# Altium schematic sheet POWER_NODE.SchDoc
size A
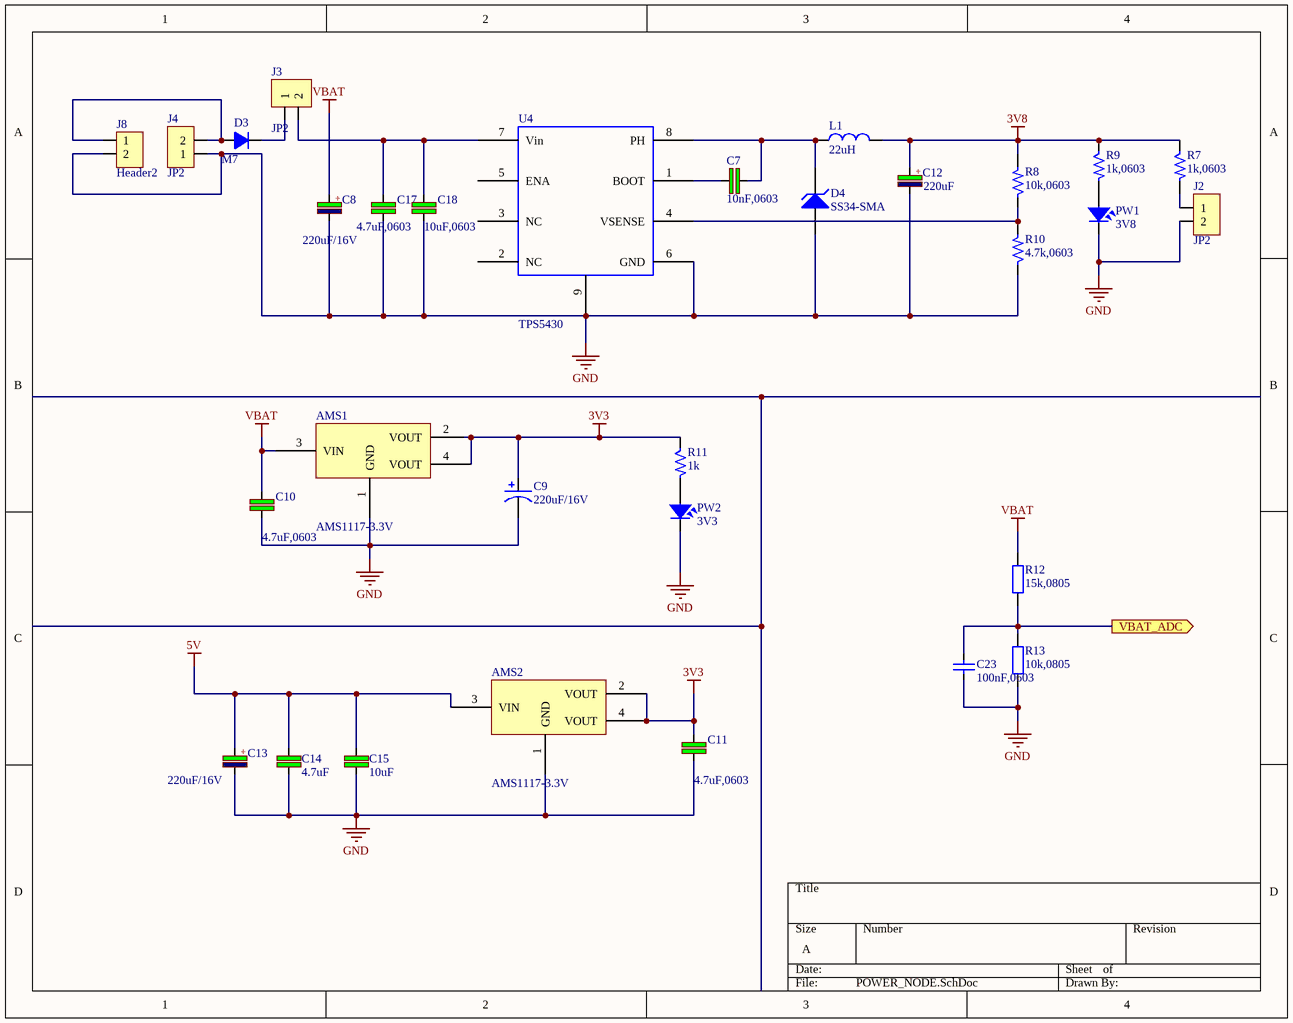
[diagram p0: POWER_NODE.SchDoc]

## Parts
AMS1  AMS1117-3.3V  [SOT223]
AMS2  AMS1117-3.3V  [SOT223]
C7  value 10nF,0603  [CAP_0603]  (hidden comment: 4.7uF)
C8  220uF/16V  [C8mm]
C9  220uF/16V  [C5mm]
C10  value 4.7uF,0603  [CAP_0603]  (hidden comment: 33pF)
C11  value 4.7uF,0603  [CAP_0603]  (hidden comment: 33pF)
C12  220uF  [C5mm]
C13  220uF/16V  [C8mm]
C14  4.7uF  [CAP_0603]
C15  10uF  [CAP_0603]
C17  value 4.7uF,0603  [CAP_0603]  (hidden comment: 4.7uF)
C18  value 10uF,0603  [CAP_0603]  (hidden comment: 4.7uF)
C23  100nF,0603  [CAP_0603]
D3  M7  [SMA]
D4  SS34-SMA  [SMA]
J2  JP2  [JP2-D1T]
J3  JP2  [KF2-5.08]
J4  JP2  [KF2-5.08]
J8  Header2  [KF2-5.08]
L1  22uH  [L-SMD-M-7.3x4.5]
PW1  3V8  [LED-0805-Blue]
PW2  3V3  [LED-0805-Blue]
R7  1k,0603  [RES-SMD-0603]
R8  10k,0603  [RES-SMD-0603]
R9  1k,0603  [RES-SMD-0603]
R10  4.7k,0603  [RES-SMD-0603]
R11  1k  [RES-SMD-0603]
R12  15k,0805  [RES-SMD-0805]
R13  10k,0805  [RES-SMD-0805]
U4  TPS5430  [TPS5430-2]

## Ports
VBAT_ADC (out)

## Nets
3V3: AMS1.2(VOUT) AMS1.4(VOUT) AMS2.2(VOUT) AMS2.4(VOUT) C9.1 C11.2 R11.1
3V8: C12.1 L1.2 R7.1 R8.2 R9.1
5V: AMS2.3(VIN) C13.1 C14.1 C15.1
GND: AMS1.1(GND) AMS2.1(GND) C8.2 C9.2 C10.1 C11.1 C12.2 C13.2 C14.2 C15.2 C17.1 C18.1 C23.1 D4.1(A) J2.2 J4.1 J8.2 PW1.2 PW2.2 R10.1 R13.1 U4.6(GND) U4.9(PWR_PAD)
VBAT: AMS1.3(VIN) C8.1 C10.2 R12.2
VBAT_ADC: C23.2 R12.1 R13.2 ; port VBAT_ADC
NetC7_1: C7.1 D4.2(K) L1.1 U4.8(PH)
NetC7_2: C7.2 U4.1(BOOT)
NetC17_2: C17.2 C18.2 J3.2 U4.7(Vin)
NetD3_1: D3.1(A) J4.2 J8.1
NetD3_2: D3.2(K) J3.1
NetJ2_1: J2.1 R7.2
NetPW1_1: PW1.1 R9.2
NetPW2_1: PW2.1 R11.2
NetR8_1: R8.1 R10.2 U4.4(VSENSE)

Not connected (* = marked no-connect by the designer): U4 2(NC) 3(NC) 5(ENA)

## Notes on the sheet
- (in symbol CP3) +
- (in symbol CP5) +

## Library data of the parts
AMS1 AMS2 = AMS1117 SMD: Dán; Value: AMS1117-3.3V SOT223; Don_Vi: Con; Ma_Hang: MH000596; Ghi_Chu: *; Kieu_Chan: *; Chung_Loai: Dán
C7 C10 C11 C17 C18 = C: 4.7µF ±10% 35V Ceramic Capacitor X5R 0805 (2012 Metric); Manufacturer: Samsung Electro-Mechanics; Part number: CL21A475KLCLQNC; User_Description: CAP CER 4.7UF 35V X5R 0805; Category: CAPACITOR; Package: 0805
C8 C13 = CP3: Cap 470uF/63V; Value: Cap 470uF/63V
C9 = Cap Pol: Polarized Capacitor (Axial); Published: 8-Jun-2000; LatestRevisionDate: 17-Jul-2002; LatestRevisionNote: Re-released for DXP Platform.; PackageReference: POLAR0.8; Publisher: Altium Limited
C12 = CP5: 220µF Molded Tantalum Polymer Capacitor 16V 2917 (7343 Metric) 40mOhm @ 100kHz; Manufacturer: AVX Corporation; Part number: TCME227M016R0040E; User_Description: CAP TANT POLY 220UF 16V 2917; Value: 220uF; Category: CAPACITOR; Package: 2917
C14 = C: Cap SMD; Manufacturer: Samsung Electro-Mechanics; Part number: CL21A106KPFNNNG; Value: 10uF; User_Description: CAP CER 10UF 10V X5R 0805; Category: CAPACITOR; Package: 0805
C15 = C: Cap SMD; Manufacturer: Samsung Electro-Mechanics; Part number: CL21A106KPFNNNG; User_Description: CAP CER 10UF 10V X5R 0805; Value: 10uF; Category: CAPACITOR; Package: 0805
C23 = CapSMD: Capacitor; Value: 33p; Published: 8-Jun-2000; LatestRevisionDate: 17-Jul-2002; LatestRevisionNote: Re-released for DXP Platform.; PackageReference: RAD-0.3; Publisher: Altium Limited
D3 = D1A: Diode 1A; Value: 1N4007
D4 = Diode Zener: Zener Diode; Published: 8-Jun-2000; LatestRevisionDate: 17-Jul-2002; LatestRevisionNote: Re-released for DXP Platform.; PackageReference: DIODE-0.7; Publisher: Altium Limited
J2-J4 = JP2: WR-PHD 2.54 mm Angled Socket Header; Manufacturer: W¨¹rth Elektronik eiSos GmbH; partNo: 613002143121; ComponentLink1 Description: Manufacturer; ComponentLink2 Description: Datasheet; NoPins: 02; Created Date: 29 March 2013; ComponentLink1URL: http://www.we-online.com; ComponentLink2URL: http://katalog.we-online.de/em/datasheet/6130xx143121.pdf; Created by: Karrer Zheng
J8 = Header2: Header IDC, 2 x 1 Pin Vertical 2.54mm Pitch (Non-Boxed, Male); Manufacturer: W¨¹rth Elektronik eiSos GmbH; partNo: 613002143121; ComponentLink1 Description: Manufacturer; ComponentLink2 Description: Datasheet; NoPins: 02; Created Date: 29 March 2013; ComponentLink1URL: http://www.we-online.com; ComponentLink2URL: http://katalog.we-online.de/em/datasheet/6130xx143121.pdf; Created by: Karrer Zheng
L1 = L1: 22µH Shielded Inductor 1.65A 96mOhm Max Nonstandard; Manufacturer: Bourns Inc.; Part Number: SRR0745A-220M; Value: 220uH; User_Description: FIXED IND 22UH 1.65A 96 MOHM SMD; Category: INDUCTORS; Package: SMD
PW1 PW2 = LED: LED RED DIFFUSED 0805 SMD; Manufacturer: OSRAM Opto Semiconductors Inc.; Part number: LS R976-NR-1; Value: Red; Category: LED SMD; Package: 0805; User_Description: LED RED DIFFUSED 0805 SMD
R7 R9 R11 = R: Resistor 1/4W; Manufacturer: Yageo; Part number: RC0805FR-071KL; User_Description: RES SMD 1K OHM 1% 1/8W 0805; Value: 1k; Category: RESISTORS; Package: 0805
R8 = R: RES SMD 10K OHM 1% 1/8W 0805; Manufacturer: Yageo; Part number: RC0805FR-0710KL; Category: RESISTORS; Package: 0805; User_Description: RES SMD 10K OHM 1% 1/8W 0805; Value: 10k
R10 = R: RES SMD 3.3K OHM 1% 1/8W 0805; Manufacturer: Yageo; Part number: RC0805FR-073K3L; Category: RESISTORS; Package: 0805; User_Description: RES SMD 3.3K OHM 1% 1/8W 0805; Value: 3.3k
R12 R13 = Resistor - SMD: Resistor SMD; Manufacturer: Generic Components; Class: Passive; Published: 08/06/2000; Publisher: Altium Hobart Technology Centre
U4 = TPS5430: Name: TPS5430